# EAGLE board aleph-130111 (EAGLE 5.11), part 1 of 3
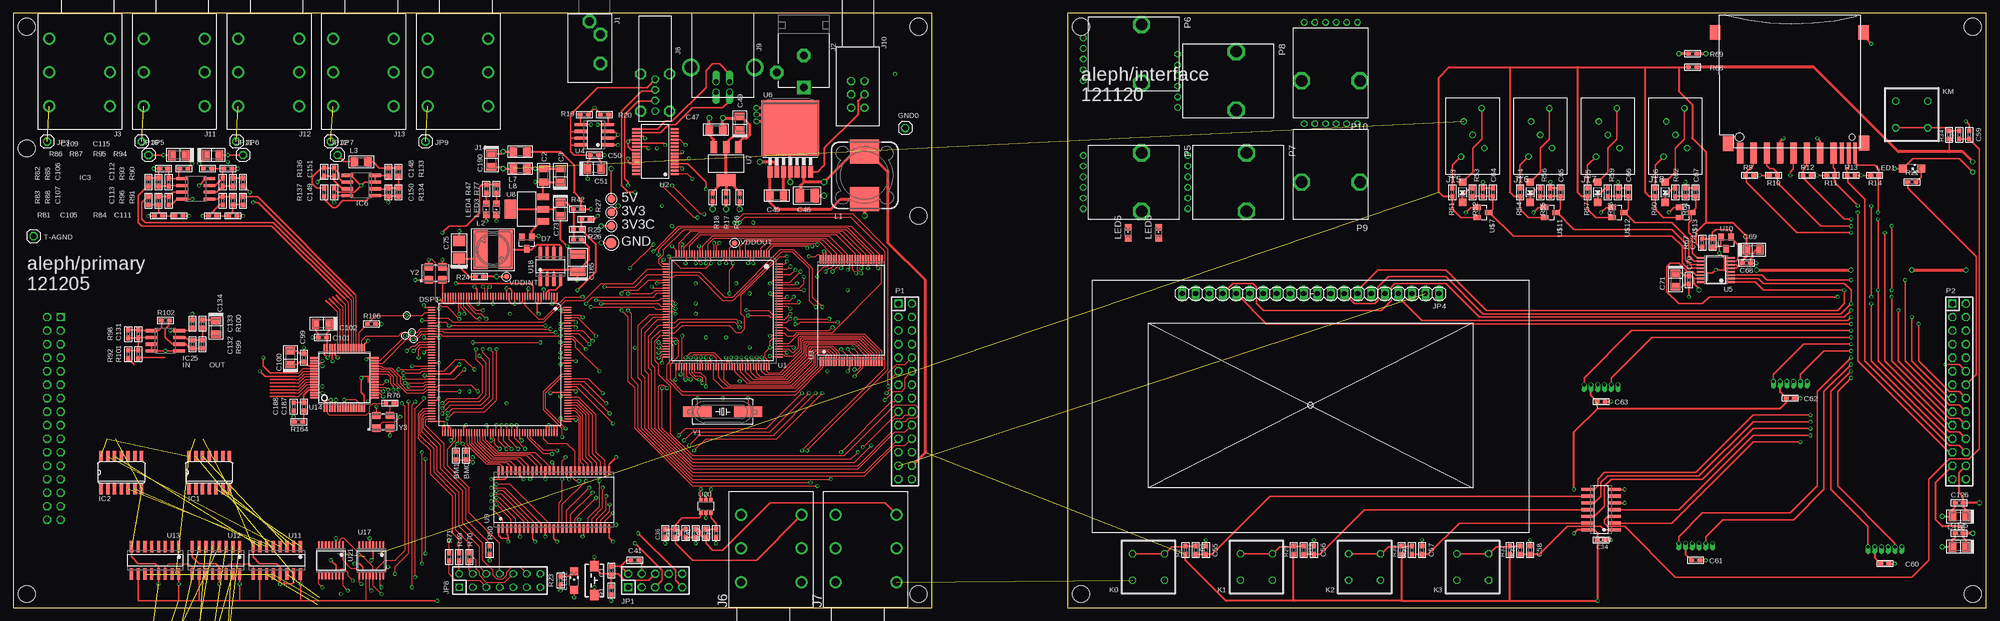
[diagram p8: board, top side]
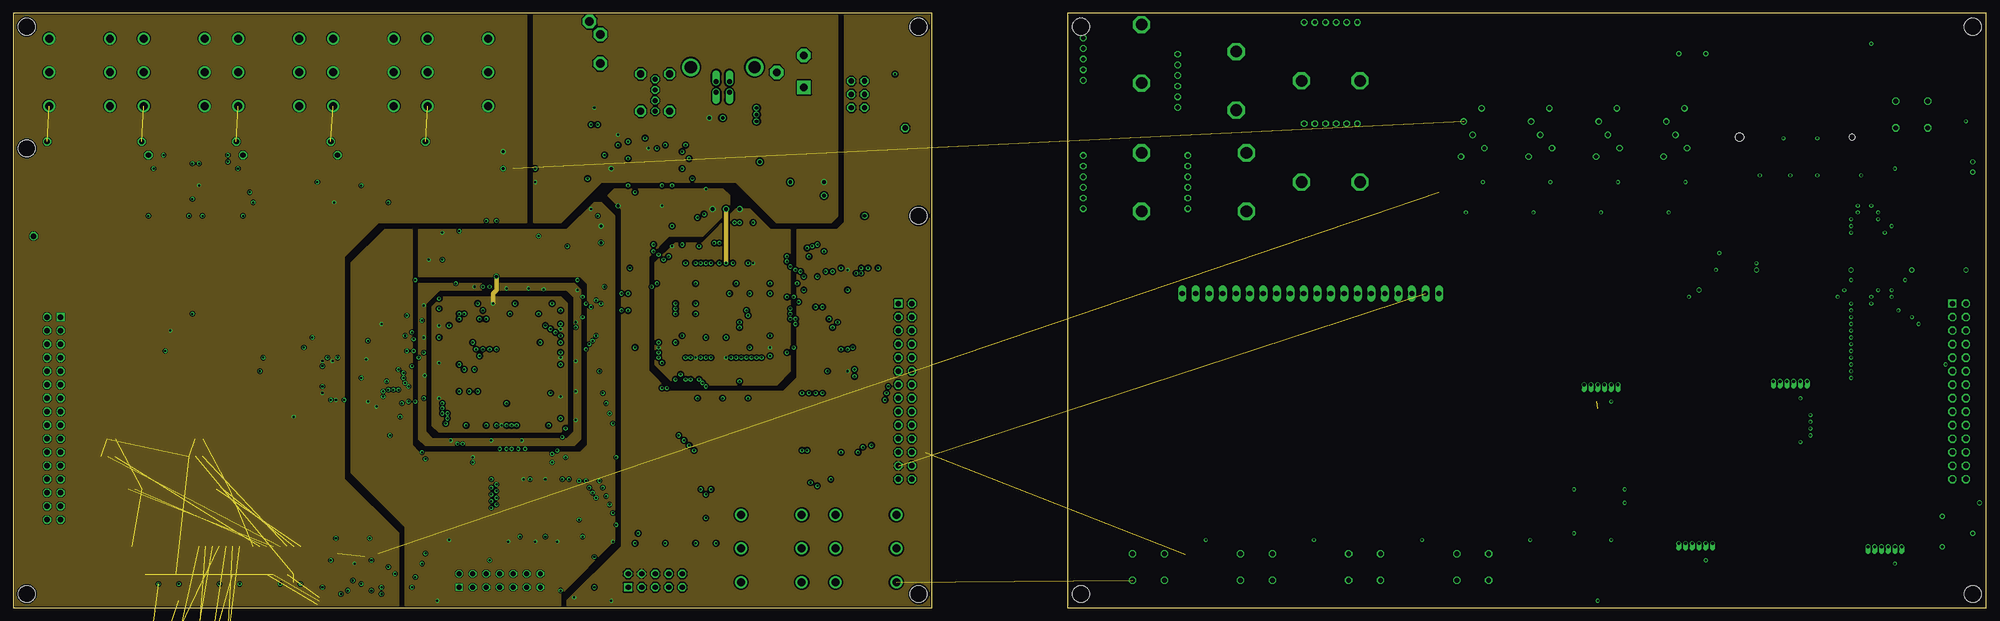
[diagram p9: board, inner layer Route2]
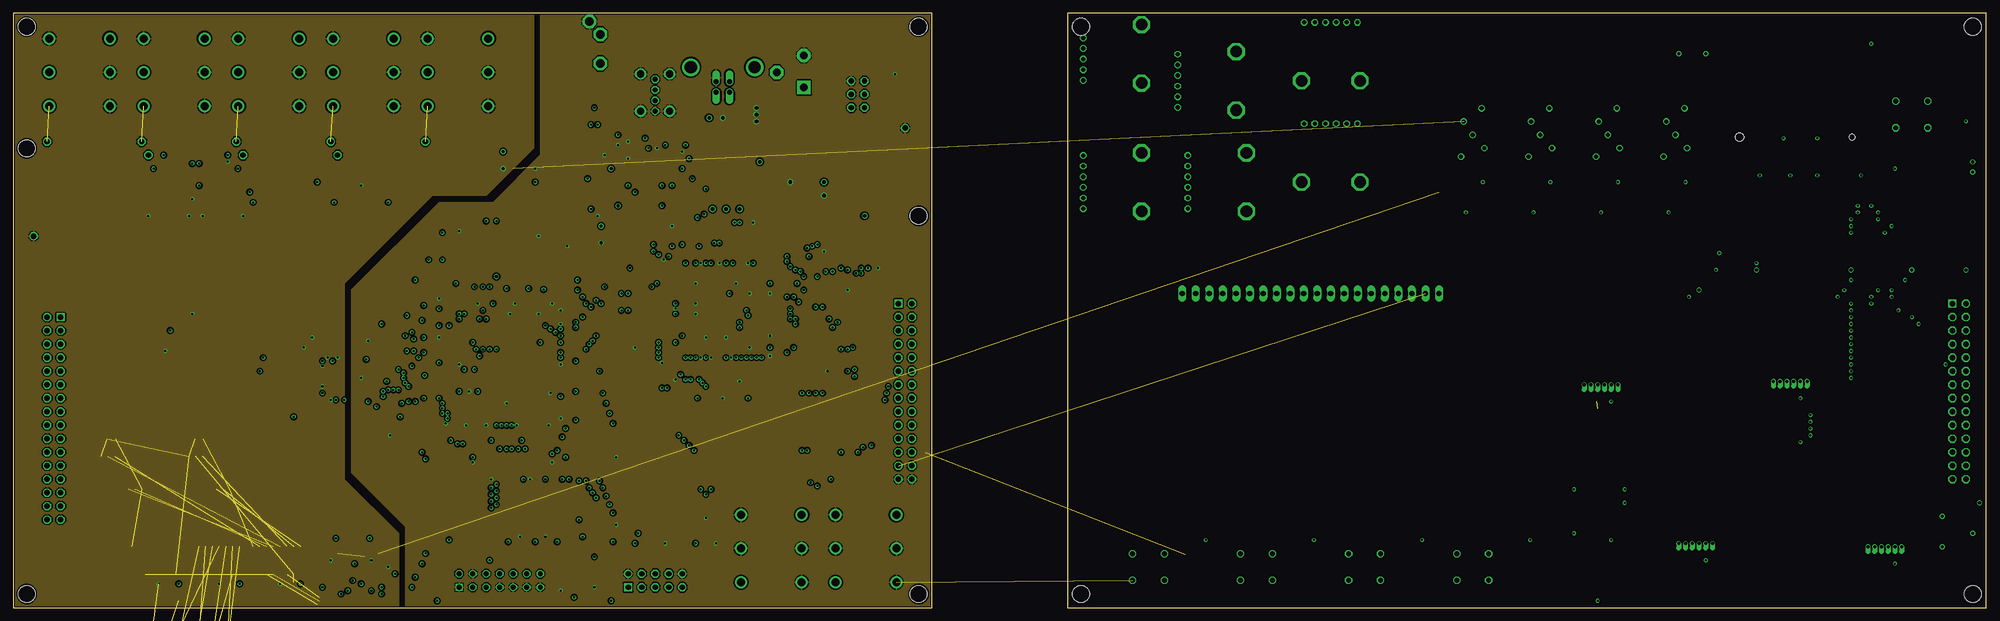
[diagram p10: board, inner layer Route3]
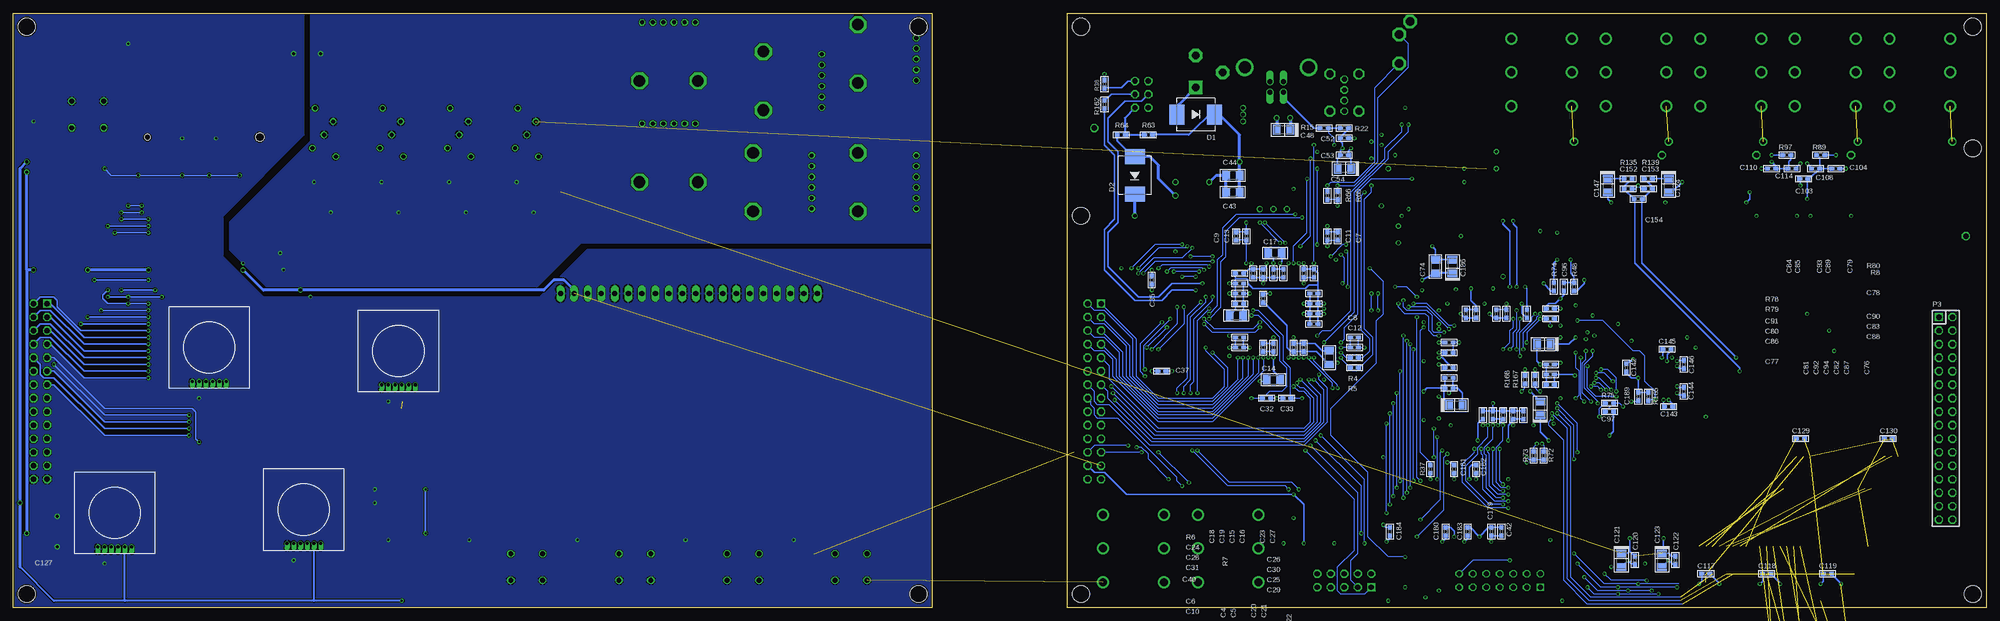
[diagram p11: board, bottom side, seen from below]

Size 370.84 x 111.76 mm. Coordinates in mm from the lower left corner, seen from the top.
Outline: 0,0 172.72,0 172.72,111.76 0,111.76 0,0
Outline: 198.12,0 370.84,0 370.84,111.76 198.12,111.76 198.12,0
Copper layers (1*2+3*16): Top 0.035mm / dielectric 1.5mm / Route2 0.035mm / dielectric 0.15mm / Route3 0.035mm / dielectric 0.2mm / Bottom 0.035mm
Design rules "default *": minimum track width 6mil, minimum drill 15mil, track to track 6mil, track to pad 6mil, pad to pad 6mil, via to via 6mil, smd to smd 6mil, copper to edge 10mil, drill to drill 8mil, minimum pad ring 6mil, minimum via ring 6mil, stop-mask expansion 4mil, vias tented up to drill 0mil, thermal gap 10mil
Holes 3.2 mm at 170.18,109.22 2.54,109.22 2.54,2.54 170.18,2.54 2.54,86.36 170.18,73.66 200.66,2.54 200.66,109.22 368.3,109.22 368.3,2.54

## Footprints (pad centres in the part's own frame; a part is rotated, then mirrored left to right if it is on the bottom)
SMD-15R = smd 1.5 x 1.5: TP 0,0
R0603 = smd 0.9 x 0.8: 1 -0.762,0; 2 0.762,0
C0603 = smd 0.9 x 0.8: 1 -0.762,0; 2 0.762,0
C1206 = smd 1.4 x 1.8: 1 -1.27,0; 2 1.27,0
C1206/T = smd 1.4 x 1.9: + 1.27,0; - -1.27,0
C3225 = smd 1.6 x 2.7: 1 -1.397,0; 2 1.397,0
C3528/T = smd 2 x 2.2: + 1.651,0; - -1.651,0
C1210/T = smd 1.6 x 3: + 1.651,0; - -1.651,0
SMC = smd 2.8 x 3.8: A 3.493,0; C -3.493,0
SOD123 = smd 1.4 x 1.4: A 1.905,0; C -1.905,0
SOT23 = smd 1 x 1.4: 1 -0.95,-1.1; 2 0.95,-1.1; 3 0,1.1
LQFP176 = smd 1.5 x 0.25: P$1 -12.8,10.75; P$2 -12.8,10.25; P$3 -12.8,9.75; P$4 -12.8,9.25; P$5 -12.8,8.75; P$6 -12.8,8.25; P$7 -12.8,7.75; P$8 -12.8,7.25; P$9 -12.8,6.75; P$10 -12.8,6.25; P$11 -12.8,5.75; P$12 -12.8,5.25; P$13 -12.8,4.75; P$14 -12.8,4.25; P$15 -12.8,3.75; P$16 -12.8,3.25; P$17 -12.8,2.75; P$18 -12.8,2.25; P$19 -12.8,1.75; P$20 -12.8,1.25; P$21 -12.8,0.75; P$22 -12.8,0.25; P$23 -12.8,-0.25; P$24 -12.8,-0.75; P$25 -12.8,-1.25; P$26 -12.8,-1.75; P$27 -12.8,-2.25; P$28 -12.8,-2.75; P$29 -12.8,-3.25; P$30 -12.8,-3.75; P$31 -12.8,-4.25; P$32 -12.8,-4.75; P$33 -12.8,-5.25; P$34 -12.8,-5.75; P$35 -12.8,-6.25; P$36 -12.8,-6.75; P$37 -12.8,-7.25; P$38 -12.8,-7.75; P$39 -12.8,-8.25; P$40 -12.8,-8.75; P$41 -12.8,-9.25; P$42 -12.8,-9.75; P$43 -12.8,-10.25; P$44 -12.8,-10.75; P$89 12.8,-10.75; P$90 12.8,-10.25; P$91 12.8,-9.75; P$92 12.8,-9.25; P$93 12.8,-8.75; P$94 12.8,-8.25; P$95 12.8,-7.75; P$96 12.8,-7.25; P$97 12.8,-6.75; P$98 12.8,-6.25; P$99 12.8,-5.75; P$100 12.8,-5.25; P$101 12.8,-4.75; P$102 12.8,-4.25; P$103 12.8,-3.75; P$104 12.8,-3.25; P$105 12.8,-2.75; P$106 12.8,-2.25; P$107 12.8,-1.75; P$108 12.8,-1.25; P$109 12.8,-0.75; P$110 12.8,-0.25; P$111 12.8,0.25; P$112 12.8,0.75; P$113 12.8,1.25; P$114 12.8,1.75; P$115 12.8,2.25; P$116 12.8,2.75; P$117 12.8,3.25; P$118 12.8,3.75; P$119 12.8,4.25; P$120 12.8,4.75; P$121 12.8,5.25; P$122 12.8,5.75; P$123 12.8,6.25; P$124 12.8,6.75; P$125 12.8,7.25; P$126 12.8,7.75; P$127 12.8,8.25; P$128 12.8,8.75; P$129 12.8,9.25; P$130 12.8,9.75; P$131 12.8,10.25; P$132 12.8,10.75 | smd 0.25 x 1.5: P$45 -10.75,-12.8; P$46 -10.25,-12.8; P$47 -9.75,-12.8; P$48 -9.25,-12.8; P$49 -8.75,-12.8; P$50 -8.25,-12.8; P$51 -7.75,-12.8; P$52 -7.25,-12.8; P$53 -6.75,-12.8; P$54 -6.25,-12.8; P$55 -5.75,-12.8; P$56 -5.25,-12.8; P$57 -4.75,-12.8; P$58 -4.25,-12.8; P$59 -3.75,-12.8; P$60 -3.25,-12.8; P$61 -2.75,-12.8; P$62 -2.25,-12.8; P$63 -1.75,-12.8; P$64 -1.25,-12.8; P$65 -0.75,-12.8; P$66 -0.25,-12.8; P$67 0.25,-12.8; P$68 0.75,-12.8; P$69 1.25,-12.8; P$70 1.75,-12.8; P$71 2.25,-12.8; P$72 2.75,-12.8; P$73 3.25,-12.8; P$74 3.75,-12.8; P$75 4.25,-12.8; P$76 4.75,-12.8; P$77 5.25,-12.8; P$78 5.75,-12.8; P$79 6.25,-12.8; P$80 6.75,-12.8; P$81 7.25,-12.8; P$82 7.75,-12.8; P$83 8.25,-12.8; P$84 8.75,-12.8; P$85 9.25,-12.8; P$86 9.75,-12.8; P$87 10.25,-12.8; P$88 10.75,-12.8; P$133 10.75,12.8; P$134 10.25,12.8; P$135 9.75,12.8; P$136 9.25,12.8; P$137 8.75,12.8; P$138 8.25,12.8; P$139 7.75,12.8; P$140 7.25,12.8; P$141 6.75,12.8; P$142 6.25,12.8; P$143 5.75,12.8; P$144 5.25,12.8; P$145 4.75,12.8; P$146 4.25,12.8; P$147 3.75,12.8; P$148 3.25,12.8; P$149 2.75,12.8; P$150 2.25,12.8; P$151 1.75,12.8; P$152 1.25,12.8; P$153 0.75,12.8; P$154 0.25,12.8; P$155 -0.25,12.8; P$156 -0.75,12.8; P$157 -1.25,12.8; P$158 -1.75,12.8; P$159 -2.25,12.8; P$160 -2.75,12.8; P$161 -3.25,12.8; P$162 -3.75,12.8; P$163 -4.25,12.8; P$164 -4.75,12.8; P$165 -5.25,12.8; P$166 -5.75,12.8; P$167 -6.25,12.8; P$168 -6.75,12.8; P$169 -7.25,12.8; P$170 -7.75,12.8; P$171 -8.25,12.8; P$172 -8.75,12.8; P$173 -9.25,12.8; P$174 -9.75,12.8; P$175 -10.25,12.8; P$176 -10.75,12.8
SMD-20R = smd 2 x 2: TP 0,0
1X01 = drill 1.016 octagon: 1 0,0
SO14 = smd 0.66 x 2.032: 1 -3.81,-3.073; 2 -2.54,-3.073; 3 -1.27,-3.073; 4 0,-3.073; 5 1.27,-3.073; 6 2.54,-3.073; 7 3.81,-3.073; 8 3.81,3.073; 9 2.54,3.073; 10 1.27,3.073; 11 0,3.073; 12 -1.27,3.073; 13 -2.54,3.073; 14 -3.81,3.073
SO8 = smd 0.6 x 2.2: 1 -1.905,-2.6; 2 -0.635,-2.6; 3 0.635,-2.6; 4 1.905,-2.6; 5 1.905,2.6; 6 0.635,2.6; 7 -0.635,2.6; 8 -1.905,2.6
SO08 = smd 0.6 x 2.2: 1 -1.905,-2.6; 2 -0.635,-2.6; 3 0.635,-2.6; 4 1.905,-2.6; 5 1.905,2.6; 6 0.635,2.6; 7 -0.635,2.6; 8 -1.905,2.6
SJ1-3533NG = drill 1.6 pad 2.54 octagon: 1 -1,-0.9; 2 1.4,1.1; 3 6.9,1.1
PJ-102XH = drill 1.422 pad 2.54 square: 1 0,0 | drill 1.422 pad 2.54 octagon: 2 0,-6.032; 3 5.08,-2.857
NEUTRIK-NRJ6HM-1 = drill 1.5 round: R 7.23,11.1; RN -4.2,11.1; S 7.23,4.75; SN -4.2,4.75; T 7.23,17.45; TN -4.2,17.45
DIL-100-2X08 = drill 1.016 square: 1 -8.89,-1.27 | drill 1.016 octagon: 2 -8.89,1.27; 3 -6.35,-1.27; 4 -6.35,1.27; 5 -3.81,-1.27; 6 -3.81,1.27; 7 -1.27,-1.27; 8 -1.27,1.27; 9 1.27,-1.27; 10 1.27,1.27; 11 3.81,-1.27; 12 3.81,1.27; 13 6.35,-1.27; 14 6.35,1.27; 15 8.89,-1.27; 16 8.89,1.27
USBA-VERT = drill 0.92 octagon: 1 0,-6; 2 0,-4; 3 0,-2; 4 0,0 | drill 1.35 octagon: G1 -2.72,0; G2 -2.72,-7; G3 2.72,-7; G4 2.72,0
USB_B = drill 0.95 offset: DM -1.25,4.71; DP -1.25,2.71; GND 1.25,2.71; VCC 1.25,4.71 | drill 2.3 round: MOUNT1 -6,0; MOUNT2 6,0
PHA2U = drill 1 octagon: 0 -1.25,0; 1 -1.25,-2.5; 2 -1.25,2.5; _0 1.25,0; _1 1.25,-2.5; _2 1.25,2.5
STX-3680 = drill 0.8 round: 1 -2.2,-4.1; 2 2.2,-2.5; 3 -1.7,2.5; 4 1.7,5; 5 0,0
AVR-JTAG-10 = drill 1.016 square: 1 -5.08,-1.27 | drill 1.016 octagon: 2 -5.08,1.27; 3 -2.54,-1.27; 4 -2.54,1.27; 5 0,-1.27; 6 0,1.27; 7 2.54,-1.27; 8 2.54,1.27; 9 5.08,-1.27; 10 5.08,1.27
1X20 = drill 1.016 long: 1 -24.13,0; 2 -21.59,0; 3 -19.05,0; 4 -16.51,0; 5 -13.97,0; 6 -11.43,0; 7 -8.89,0; 8 -6.35,0; 9 -3.81,0; 10 -1.27,0; 11 1.27,0; 12 3.81,0; 13 6.35,0; 14 8.89,0; 15 11.43,0; 16 13.97,0; 17 16.51,0; 18 19.05,0; 19 21.59,0; 20 24.13,0
JPQ-07 = drill 0.914 square: 1 -7.62,-1.27 | drill 0.914 octagon: 2 -7.62,1.27; 3 -5.08,-1.27; 4 -5.08,1.27; 5 -2.54,-1.27; 6 -2.54,1.27; 7 0,-1.27; 8 0,1.27; 9 2.54,-1.27; 10 2.54,1.27; 11 5.08,-1.27; 12 5.08,1.27; 13 7.62,-1.27; 14 7.62,1.27
PVA1 = drill 0.9 octagon: 1 -3,-2.5; 2 -3,2.5; 3 3,2.5; 4 3,-2.5
MSS1278 = smd 5.5 x 4.5: 1 0,4.5; 2 0,-4.5
SRR6038 = smd 7.3 x 2.6: 1 0,2.35; 2 0,-2.35
L1206 = smd 1.4 x 1.8: 1 -1.27,0; 2 1.27,0
CHIPLED_1206 = smd 1.5 x 1.5: A 0,-1.75; C 0,1.75
CHIPLED_0805 = smd 1.2 x 1.2: A 0,-1.05; C 0,1.05
DIL-100-2X14 = drill 1.016 square: 1 -16.51,-1.27 | drill 1.016 octagon: 2 -16.51,1.27; 3 -13.97,-1.27; 4 -13.97,1.27; 5 -11.43,-1.27; 6 -11.43,1.27; 7 -8.89,-1.27; 8 -8.89,1.27; 9 -6.35,-1.27; 10 -6.35,1.27; 11 -3.81,-1.27; 12 -3.81,1.27; 13 -1.27,-1.27; 14 -1.27,1.27; 15 1.27,-1.27; 16 1.27,1.27; 17 3.81,-1.27; 18 3.81,1.27; 19 6.35,-1.27; 20 6.35,1.27; 21 8.89,-1.27; 22 8.89,1.27; 23 11.43,-1.27; 24 11.43,1.27; 25 13.97,-1.27; 26 13.97,1.27; 27 16.51,-1.27; 28 16.51,1.27
DIL-100-2X16 = drill 1.016 square: 1 -19.05,-1.27 | drill 1.016 octagon: 2 -19.05,1.27; 3 -16.51,-1.27; 4 -16.51,1.27; 5 -13.97,-1.27; 6 -13.97,1.27; 7 -11.43,-1.27; 8 -11.43,1.27; 9 -8.89,-1.27; 10 -8.89,1.27; 11 -6.35,-1.27; 12 -6.35,1.27; 13 -3.81,-1.27; 14 -3.81,1.27; 15 -1.27,-1.27; 16 -1.27,1.27; 17 1.27,-1.27; 18 1.27,1.27; 19 3.81,-1.27; 20 3.81,1.27; 21 6.35,-1.27; 22 6.35,1.27; 23 8.89,-1.27; 24 8.89,1.27; 25 11.43,-1.27; 26 11.43,1.27; 27 13.97,-1.27; 28 13.97,1.27; 29 16.51,-1.27; 30 16.51,1.27; 31 19.05,-1.27; 32 19.05,1.27
EVJ-POT = drill 0.8 octagon: 1 -5,-11; 2 -3,-11; 3 -1,-11; 4 1,-11; 5 3,-11; 6 5,-11 | drill 2.2 octagon: M1 -5.5,0; M2 5.5,0
LQFP144 = smd 0.25 x 1.5: 1 -8.75,-10.6; 2 -8.25,-10.6; 3 -7.75,-10.6; 4 -7.25,-10.6; 5 -6.75,-10.6; 6 -6.25,-10.6; 7 -5.75,-10.6; 8 -5.25,-10.6; 9 -4.75,-10.6; 10 -4.25,-10.6; 11 -3.75,-10.6; 12 -3.25,-10.6; 13 -2.75,-10.6; 14 -2.25,-10.6; 15 -1.75,-10.6; 16 -1.25,-10.6; 17 -0.75,-10.6; 18 -0.25,-10.6; 19 0.25,-10.6; 20 0.75,-10.6; 21 1.25,-10.6; 22 1.75,-10.6; 23 2.25,-10.6; 24 2.75,-10.6; 25 3.25,-10.6; 26 3.75,-10.6; 27 4.25,-10.6; 28 4.75,-10.6; 29 5.25,-10.6; 30 5.75,-10.6; 31 6.25,-10.6; 32 6.75,-10.6; 33 7.25,-10.6; 34 7.75,-10.6; 35 8.25,-10.6; 36 8.75,-10.6; 73 8.75,10.6; 74 8.25,10.6; 75 7.75,10.6; 76 7.25,10.6; 77 6.75,10.6; 78 6.25,10.6; 79 5.75,10.6; 80 5.25,10.6; 81 4.75,10.6; 82 4.25,10.6; 83 3.75,10.6; 84 3.25,10.6; 85 2.75,10.6; 86 2.25,10.6; 87 1.75,10.6; 88 1.25,10.6; 89 0.75,10.6; 90 0.25,10.6; 91 -0.25,10.6; 92 -0.75,10.6; 93 -1.25,10.6; 94 -1.75,10.6; 95 -2.25,10.6; 96 -2.75,10.6; 97 -3.25,10.6; 98 -3.75,10.6; 99 -4.25,10.6; 100 -4.75,10.6; 101 -5.25,10.6; 102 -5.75,10.6; 103 -6.25,10.6; 104 -6.75,10.6; 105 -7.25,10.6; 106 -7.75,10.6; 107 -8.25,10.6; 108 -8.75,10.6 | smd 1.5 x 0.25: 37 10.6,-8.75; 38 10.6,-8.25; 39 10.6,-7.75; 40 10.6,-7.25; 41 10.6,-6.75; 42 10.6,-6.25; 43 10.6,-5.75; 44 10.6,-5.25; 45 10.6,-4.75; 46 10.6,-4.25; 47 10.6,-3.75; 48 10.6,-3.25; 49 10.6,-2.75; 50 10.6,-2.25; 51 10.6,-1.75; 52 10.6,-1.25; 53 10.6,-0.75; 54 10.6,-0.25; 55 10.6,0.25; 56 10.6,0.75; 57 10.6,1.25; 58 10.6,1.75; 59 10.6,2.25; 60 10.6,2.75; 61 10.6,3.25; 62 10.6,3.75; 63 10.6,4.25; 64 10.6,4.75; 65 10.6,5.25; 66 10.6,5.75; 67 10.6,6.25; 68 10.6,6.75; 69 10.6,7.25; 70 10.6,7.75; 71 10.6,8.25; 72 10.6,8.75; 109 -10.6,8.75; 110 -10.6,8.25; 111 -10.6,7.75; 112 -10.6,7.25; 113 -10.6,6.75; 114 -10.6,6.25; 115 -10.6,5.75; 116 -10.6,5.25; 117 -10.6,4.75; 118 -10.6,4.25; 119 -10.6,3.75; 120 -10.6,3.25; 121 -10.6,2.75; 122 -10.6,2.25; 123 -10.6,1.75; 124 -10.6,1.25; 125 -10.6,0.75; 126 -10.6,0.25; 127 -10.6,-0.25; 128 -10.6,-0.75; 129 -10.6,-1.25; 130 -10.6,-1.75; 131 -10.6,-2.25; 132 -10.6,-2.75; 133 -10.6,-3.25; 134 -10.6,-3.75; 135 -10.6,-4.25; 136 -10.6,-4.75; 137 -10.6,-5.25; 138 -10.6,-5.75; 139 -10.6,-6.25; 140 -10.6,-6.75; 141 -10.6,-7.25; 142 -10.6,-7.75; 143 -10.6,-8.25; 144 -10.6,-8.75
SSOP28 = smd 0.4 x 1.5: 1 -4.225,-3.625; 2 -3.575,-3.625; 3 -2.925,-3.625; 4 -2.275,-3.625; 5 -1.625,-3.625; 6 -0.975,-3.625; 7 -0.325,-3.625; 8 0.325,-3.625; 9 0.975,-3.625; 10 1.625,-3.625; 11 2.275,-3.625; 12 2.925,-3.625; 13 3.575,-3.625; 14 4.225,-3.625; 15 4.225,3.625; 16 3.575,3.625; 17 2.925,3.625; 18 2.275,3.625; 19 1.625,3.625; 20 0.975,3.625; 21 0.325,3.625; 22 -0.325,3.625; 23 -0.975,3.625; 24 -1.625,3.625; 25 -2.275,3.625; 26 -2.925,3.625; 27 -3.575,3.625; 28 -4.225,3.625
TSOP48 = smd 0.3 x 1.6: 1 -5.75,-9.6; 2 -5.25,-9.6; 3 -4.75,-9.6; 4 -4.25,-9.6; 5 -3.75,-9.6; 6 -3.25,-9.6; 7 -2.75,-9.6; 8 -2.25,-9.6; 9 -1.75,-9.6; 10 -1.25,-9.6; 11 -0.75,-9.6; 12 -0.25,-9.6; 13 0.25,-9.6; 14 0.75,-9.6; 15 1.25,-9.6; 16 1.75,-9.6; 17 2.25,-9.6; 18 2.75,-9.6; 19 3.25,-9.6; 20 3.75,-9.6; 21 4.25,-9.6; 22 4.75,-9.6; 23 5.25,-9.6; 24 5.75,-9.6; 25 5.75,9.6; 26 5.25,9.6; 27 4.75,9.6; 28 4.25,9.6; 29 3.75,9.6; 30 3.25,9.6; 31 2.75,9.6; 32 2.25,9.6; 33 1.75,9.6; 34 1.25,9.6; 35 0.75,9.6; 36 0.25,9.6; 37 -0.25,9.6; 38 -0.75,9.6; 39 -1.25,9.6; 40 -1.75,9.6; 41 -2.25,9.6; 42 -2.75,9.6; 43 -3.25,9.6; 44 -3.75,9.6; 45 -4.25,9.6; 46 -4.75,9.6; 47 -5.25,9.6; 48 -5.75,9.6
TSSOP16 = smd 0.3 x 1.5: 1 -2.275,-2.8; 2 -1.625,-2.8; 3 -0.975,-2.8; 4 -0.325,-2.8; 5 0.325,-2.8; 6 0.975,-2.8; 7 1.625,-2.8; 8 2.275,-2.8; 9 2.275,2.8; 10 1.625,2.8; 11 0.975,2.8; 12 0.325,2.8; 13 -0.325,2.8; 14 -0.975,2.8; 15 -1.625,2.8; 16 -2.275,2.8
TO263-7 = smd 0.914 x 2.159: 1 -3.81,-5.715; 2 -2.54,-5.715; 3 -1.27,-5.715; 4 0,-5.715; 5 1.27,-5.715; 6 2.54,-5.715; 7 3.81,-5.715 | smd 10.8 x 10.41: 8 0,2.54
SOT223 = smd 1.219 x 2.235: 1 -2.311,-3.099; 2 0,-3.099; 3 2.311,-3.099 | smd 3.6 x 2.2: 4 0,3.099
TSOP54 = smd 0.4 x 1.6: 1 -10.4,-5.45; 2 -9.6,-5.45; 3 -8.8,-5.45; 4 -8,-5.45; 5 -7.2,-5.45; 6 -6.4,-5.45; 7 -5.6,-5.45; 8 -4.8,-5.45; 9 -4,-5.45; 10 -3.2,-5.45; 11 -2.4,-5.45; 12 -1.6,-5.45; 13 -0.8,-5.45; 14 0,-5.45; 15 0.8,-5.45; 16 1.6,-5.45; 17 2.4,-5.45; 18 3.2,-5.45; 19 4,-5.45; 20 4.8,-5.45; 21 5.6,-5.45; 22 6.4,-5.45; 23 7.2,-5.45; 24 8,-5.45; 25 8.8,-5.45; 26 9.6,-5.45; 27 10.4,-5.45; 28 10.4,5.45; 29 9.6,5.45; 30 8.8,5.45; 31 8,5.45; 32 7.2,5.45; 33 6.4,5.45; 34 5.6,5.45; 35 4.8,5.45; 36 4,5.45; 37 3.2,5.45; 38 2.4,5.45; 39 1.6,5.45; 40 0.8,5.45; 41 0,5.45; 42 -0.8,5.45; 43 -1.6,5.45; 44 -2.4,5.45; 45 -3.2,5.45; 46 -4,5.45; 47 -4.8,5.45; 48 -5.6,5.45; 49 -6.4,5.45; 50 -7.2,5.45; 51 -8,5.45; 52 -8.8,5.45; 53 -9.6,5.45; 54 -10.4,5.45
SO16 = smd 0.6 x 2.2: 1 -4.445,-2.6; 2 -3.175,-2.6; 3 -1.905,-2.6; 4 -0.635,-2.6; 5 0.635,-2.6; 6 1.905,-2.6; 7 3.175,-2.6; 8 4.445,-2.6; 9 4.445,2.6; 10 3.175,2.6; 11 1.905,2.6; 12 0.635,2.6; 13 -0.635,2.6; 14 -1.905,2.6; 15 -3.175,2.6; 16 -4.445,2.6
SQFP-S-10X10-64 = smd 0.3 x 1.6: 1 -3.75,-5.6; 2 -3.25,-5.6; 3 -2.75,-5.6; 4 -2.25,-5.6; 5 -1.75,-5.6; 6 -1.25,-5.6; 7 -0.75,-5.6; 8 -0.25,-5.6; 9 0.25,-5.6; 10 0.75,-5.6; 11 1.25,-5.6; 12 1.75,-5.6; 13 2.25,-5.6; 14 2.75,-5.6; 15 3.25,-5.6; 16 3.75,-5.6; 33 3.75,5.6; 34 3.25,5.6; 35 2.75,5.6; 36 2.25,5.6; 37 1.75,5.6; 38 1.25,5.6; 39 0.75,5.6; 40 0.25,5.6; 41 -0.25,5.6; 42 -0.75,5.6; 43 -1.25,5.6; 44 -1.75,5.6; 45 -2.25,5.6; 46 -2.75,5.6; 47 -3.25,5.6; 48 -3.75,5.6 | smd 1.6 x 0.3: 17 5.6,-3.75; 18 5.6,-3.25; 19 5.6,-2.75; 20 5.6,-2.25; 21 5.6,-1.75; 22 5.6,-1.25; 23 5.6,-0.75; 24 5.6,-0.25; 25 5.6,0.25; 26 5.6,0.75; 27 5.6,1.25; 28 5.6,1.75; 29 5.6,2.25; 30 5.6,2.75; 31 5.6,3.25; 32 5.6,3.75; 49 -5.6,3.75; 50 -5.6,3.25; 51 -5.6,2.75; 52 -5.6,2.25; 53 -5.6,1.75; 54 -5.6,1.25; 55 -5.6,0.75; 56 -5.6,0.25; 57 -5.6,-0.25; 58 -5.6,-0.75; 59 -5.6,-1.25; 60 -5.6,-1.75; 61 -5.6,-2.25; 62 -5.6,-2.75; 63 -5.6,-3.25; 64 -5.6,-3.75
SO14' = smd 0.6 x 2.2: 1 -3.81,-2.6; 2 -2.54,-2.6; 3 -1.27,-2.6; 4 0,-2.6; 5 1.27,-2.6; 6 2.54,-2.6; 7 3.81,-2.6; 8 3.81,2.6; 9 2.54,2.6; 10 1.27,2.6; 11 0,2.6; 12 -1.27,2.6; 13 -2.54,2.6; 14 -3.81,2.6
SOT23-6 = smd 0.6 x 0.9: 1 -0.95,-1.15; 2 0,-1.15; 3 0.95,-1.15; 4 0.95,1.15; 5 0,1.15; 6 -0.95,1.15
PANASONIC-EVQ = smd 2 x 1.6: 1 2.7,0; 2 -2.7,0
BOURNS-EM14 = drill 0.6 pad 0.813 offset: P$1 -3.175,-6.35; P$2 -1.905,-6.35; P$3 -0.635,-6.35; P$4 0.635,-6.35; P$5 1.905,-6.35; P$6 3.175,-6.35
06132 = smd 1.2 x 4: 1 6.9,0.9; 2 4.4,0.9; 3 1.9,0.9; 4 -0.6,0.9; 5 -3.1,0.9; 6 -5.6,0.9; 7 -8.1,0.9; 9 9.4,0.9 | smd 0.7 x 4: 8 -9.7,0.9; CD -11,0.9; WP -12.2,0.9 | smd 2 x 2.8: GP -13.8,-21.8; GP2 14.1,-21.8; GP3 11.7,-0.9; GP4 -13.9,-1 | hole 1.1: -11.6,-2.1 | hole 1.6: 9.5,-2.1
SMD-10R = smd 1 x 1: TP 0,0
HC49UP@1 = smd 5.334 x 1.93: 1 -4.763,0; 2 4.763,0
ASFL1 = smd 1.7 x 1.5: 1 -1.27,-1.2; 2 1.27,-1.2; 3 1.27,1.2; 4 -1.27,1.2

## Placement (x,y rotation side)
3V3  TPS-SMD-15R  [SMD-15R]  112.39,74.3 0 top
3V3C  TPS-SMD-15R  [SMD-15R]  112.39,71.75 0 top
5V  TPS-SMD-15R  [SMD-15R]  112.39,76.83 0 top
BM0  0  [R0603]  85.09,28.57 90 top
BM1  DNP  [R0603]  83.19,28.57 90 top
C1  100n  [C0603]  112.39,6.99 90 top
C2  100n  [C1206]  99.69,81.28 270 top
C3  10u  [C1206/T]  102.87,81.28 270 top
C4  100n  [C0603]  135.89,48.9 90 bottom
C5  33n  [C0603]  133.99,48.9 90 bottom
C6  100n  [C0603]  140.34,50.8 0 bottom
C7  100n  [C0603]  121.92,69.85 90 bottom
C8  100n  [C0603]  118.75,50.8 0 bottom
C9  100n  [C0603]  140.97,69.85 90 bottom
C10  33n  [C0603]  140.34,48.9 0 bottom
C11  33n  [C0603]  123.83,69.85 90 bottom
C12  33n  [C0603]  118.75,48.9 0 bottom
C13  33n  [C0603]  139.06,69.85 90 bottom
C14  4.7u  [C1206]  133.99,42.86 180 bottom
C15  33n  [C0603]  133.99,62.87 270 bottom
C16  100n  [C0603]  132.08,62.87 270 bottom
C17  4.7u  [C1206]  133.67,66.67 0 bottom
C18  2.2u  [C0603]  137.79,62.87 270 bottom
C19  470p  [C0603]  135.89,62.87 270 bottom
C20  2.7n  [C0603]  130.18,48.9 90 bottom
C21  33n  [C0603]  128.27,48.9 90 bottom
C22  2.2u  [C1206]  123.51,46.99 90 bottom
C23  2.7n  [C0603]  128.27,62.87 270 bottom
C24  2.7n  [C0603]  140.34,60.96 0 bottom
C25  2.7n  [C0603]  126.36,55.24 180 bottom
C26  2.7n  [C0603]  126.36,59.05 180 bottom
C27  33n  [C0603]  126.36,62.87 270 bottom
C28  33n  [C0603]  140.34,59.05 0 bottom
C29  33n  [C0603]  126.36,53.34 180 bottom
C30  33n  [C0603]  126.36,57.15 180 bottom
C31  100n  [C0603]  140.34,57.15 0 bottom
C32  18p  [C0603]  135.25,39.37 0 bottom
C33  18p  [C0603]  131.44,39.37 180 bottom
C34  100n  [C0603]  298.45,12.7 180 top
C35  10n  [C0603]  156.84,61.59 270 bottom
C36  1u  [C0603]  122.56,13.97 90 top
C37  10n  [C0603]  154.94,44.45 0 bottom
C38  1u  [C0603]  132.08,13.97 90 top
C39  100n  [C0603]  25.4,-11.43 90 top  (outside the outline)
C40  2.2u  [C1206]  140.97,54.93 0 bottom
C41  100n  [C0603]  116.84,8.89 180 top
C42  10n  [C0603]  91.12,14.29 270 bottom
C43  22u  [C1206]  141.6,78.11 0 bottom
C44  470n  [C1206]  141.6,81.28 0 bottom
C45  10n  [C1206]  143.51,77.47 0 top
C46  47u  [C3225]  149.22,77.47 0 top
C47  100n  [C1206]  132.08,89.85 180 top
C48  10u  [C1206/T]  132.08,89.85 0 bottom
C49  10u  [C1206/T]  136.53,91.12 270 top
C50  100n  [C0603]  109.22,85.09 180 top
C51  4.7u  [C1206/T]  109.22,82.55 180 top
C52  100n  [C0603]  120.65,88.27 0 bottom
C53  100n  [C0603]  120.65,85.09 0 bottom
C54  4.7u  [C1206/T]  120.65,82.55 0 bottom
C55  1u  [C0603]  224.16,10.79 270 top
C56  1u  [C0603]  244.47,10.79 270 top
C57  1u  [C0603]  264.8,10.79 270 top
C58  1u  [C0603]  285.12,10.79 270 top
C59  1u  [C0603]  367.67,88.9 270 top
C60  100n  [C0603]  351.79,8.26 180 top
C61  100n  [C0603]  316.23,8.89 180 top
C62  100n  [C0603]  334.01,39.37 180 top
C63  100n  [C0603]  298.45,38.73 180 top
C64  10n  [C0603]  278.13,78.11 90 top
C65  10n  [C0603]  290.83,78.11 90 top
C66  10n  [C0603]  303.53,78.11 90 top
C67  10n  [C0603]  316.23,78.11 90 top
C68  100n  [C0603]  325.75,64.77 180 top
C69  10u  [C1206/T]  327.02,67.31 180 top
C70  100n  [C0603]  314.96,61.59 90 top
C71  10u  [C1206/T]  312.42,61.59 90 top
C72  100n  [C0603]  319.4,68.58 90 top
C73  10u  [C1206/T]  102.87,74.93 90 top
C74  100n  [C1206]  103.5,64.14 270 bottom
C75  100u  [C3528/T]  83.82,67.31 270 top
C76  10u  [C1206/T]  83.82,37.47 270 bottom
C77  10u  [C1206/T]  99.69,38.1 180 bottom
C78  10u  [C1206/T]  83.19,49.53 0 bottom
C79  100n  [C0603]  86.36,55.24 90 bottom
C80  100n  [C0603]  100.97,43.18 180 bottom
C81  100n  [C0603]  94.61,36.2 270 bottom
C82  100n  [C0603]  88.9,36.2 270 bottom
C83  100n  [C0603]  81.92,43.81 0 bottom
C84  100n  [C0603]  97.79,55.24 90 bottom
C85  10n  [C0603]  95.89,55.24 90 bottom
C86  10n  [C0603]  100.97,41.27 180 bottom
C87  10n  [C0603]  87,36.2 270 bottom
C88  10n  [C0603]  81.92,41.91 0 bottom
C89  100n  [C0603]  90.17,55.24 90 bottom
C90  100n  [C0603]  81.92,45.72 0 bottom
C91  100n  [C0603]  100.97,45.09 0 bottom
C92  100n  [C0603]  92.71,36.2 270 bottom
C93  10n  [C0603]  92.08,55.24 90 bottom
C94  10n  [C0603]  90.81,36.2 270 bottom
C95  100n  [C0603]  30.48,-21.59 90 top  (outside the outline)
C96  10n  [C0603]  79.38,60.33 270 bottom
C97  10n  [C0603]  70.8,36.83 0 bottom
C99  100n  [C0603]  54.61,46.99 270 top
C100  47u  [C1206/T]  52.07,46.99 270 top
C101  100n  [C0603]  58.1,50.8 0 top
C102  10u  [C1206/T]  58.1,53.34 0 top
C103  100n  [C0603]  34.29,80.64 180 bottom
C104  270p  [C0603]  28.26,82.55 0 bottom
C105  560p  [C0603]  31.11,73.66 0 top
C106  68p  [C0603]  29.21,80.01 90 top
C107  220p  [C0603]  29.21,76.52 90 top
C108  2200p  [C0603]  32.07,82.55 180 bottom
C109  10u  [C1206/T]  31.11,85.09 0 top
C110  270p  [C0603]  40.32,82.55 180 bottom
C111  560p  [C0603]  41.27,73.66 0 top
C112  68p  [C0603]  39.37,80.01 90 top
C113  220p  [C0603]  39.37,76.52 90 top
C114  2200p  [C0603]  36.51,82.55 0 bottom
C115  10u  [C1206/T]  37.47,85.09 180 top
C117  100n  [C0603]  52.7,6.35 0 bottom
C118  100n  [C0603]  41.27,6.35 0 bottom
C119  100n  [C0603]  29.84,6.35 0 bottom
C120  100n  [C0603]  66.04,8.89 270 bottom
C121  10u  [C1206/T]  68.58,8.89 90 bottom
C122  100n  [C0603]  58.42,8.89 270 bottom
C123  10u  [C1206/T]  60.96,8.89 90 bottom
C124  4.7u  [C1206/T]  59.69,79.38 90 bottom
C125  100n  [C0603]  365.76,13.97 0 top
C126  100n  [C0603]  365.76,19.68 0 top
C127  10u  [C1206/T]  365.76,11.43 0 top
C128  10u  [C1206/T]  365.76,17.14 0 top
C129  100n  [C0603]  34.92,31.75 180 bottom
C130  100n  [C0603]  18.41,31.75 180 bottom
C131  27p  [C0603]  23.5,51.44 90 top
C132  47p  [C0603]  33.66,49.53 90 top
C133  100n  [C0603]  33.66,53.34 90 top
C134  10u  [C1206/T]  38.1,52.7 90 top
C142  100n  [C0603]  67.63,45.09 270 bottom
C143  100n  [C0603]  59.69,37.78 0 bottom
C144  100n  [C0603]  56.83,40.64 90 bottom
C145  100n  [C0603]  60.01,48.58 180 bottom
C146  100n  [C0603]  56.83,45.72 270 bottom
C147  4.7u  [C1206/T]  71.12,79.38 90 bottom
C148  100p  [C0603]  70.48,81.92 90 top
C149  100n  [C0603]  60.33,78.11 270 top
C150  120p  [C0603]  70.48,78.11 90 top
C151  120p  [C0603]  60.33,81.92 90 top
C152  1n  [C0603]  67.31,78.74 0 bottom
C153  1n  [C0603]  63.5,78.74 0 bottom
C154  100p  [C0603]  65.41,76.83 0 bottom
C179  10n  [C0603]  93.03,14.29 270 bottom
C180  10n  [C0603]  101.6,14.29 270 bottom
C181  10n  [C0603]  100.01,26.04 270 bottom
C182  10n  [C0603]  95.89,26.04 270 bottom
C183  10n  [C0603]  97.47,14.29 270 bottom
C184  10n  [C0603]  112.08,14.29 270 bottom
C185  100u  [C1210/T]  106.05,64.77 270 top
C186  10u  [C1206/T]  100.33,64.14 270 bottom
C187  5600p  [C0603]  54.61,37.78 90 top
C188  390p  [C0603]  52.7,37.78 90 top
C189  100n  [C0603]  65.41,39.69 90 bottom
C190  10u  [C1206/T]  89.85,84.14 90 top
D1  MBRS360T3  [SMC]  148.59,92.71 180 bottom
D2  MBRS360T3  [SMC]  160.02,81.28 90 bottom
D3  1N4148W-7  [SOD123]  272.42,78.11 90 top
D4  1N4148W-7  [SOD123]  285.12,78.11 90 top
D5  1N4148W-7  [SOD123]  297.81,78.11 90 top
D6  1N4148W-7  [SOD123]  310.51,78.11 90 top
D7  zhcs1000  [SOT23]  96.52,68.58 180 top
DSP1  BF533  [LQFP176]  91.44,45.72 270 top
GND  TPS-SMD-20R  [SMD-20R]  112.39,68.58 0 top
GND0  [1X01]  167.64,90.17 0 top
IC1  4066D  [SO14]  36.83,25.4 0 top
IC2  4066D  [SO14]  20.32,25.4 0 top
IC3  AD8606  [SO8]  34.29,78.74 270 top
IC4  4066D  [SO14]  31.75,-11.43 0 top  (outside the outline)
IC5  4066D  [SO14]  36.83,-21.59 0 top  (outside the outline)
IC6  AD8606  [SO8]  65.41,79.38 90 top
IC25  TL072D  [SO08]  28.57,50.16 270 top
J1  SJ1-3533NG  [SJ1-3533NG]  109.22,109.22 270 top
J2  PJ-102AH/BH  [PJ-102XH]  148.59,97.79 180 top
J3  STEREOSW2GND  [NEUTRIK-NRJ6HM-1]  13.97,111.76 180 top
J4  F-2X08-DIL-100  [DIL-100-2X08]  295.27,119.06 180 top  (outside the outline)
J5  F-2X08-DIL-100  [DIL-100-2X08]  98.42,130.18 90 top  (outside the outline)
J6  STEREOSW2GND  [NEUTRIK-NRJ6HM-1]  140.97,0 0 top
J7  STEREOSW2GND  [NEUTRIK-NRJ6HM-1]  158.75,0 0 top
J8  USBA-VERT  [USBA-VERT]  120.65,93.34 180 top
J9  [USB_B]  133.35,101.6 180 top
J10  PHA2U  [PHA2U]  158.75,96.52 180 top
J11  STEREOSW2GND  [NEUTRIK-NRJ6HM-1]  31.75,111.76 180 top
J12  STEREOSW2GND  [NEUTRIK-NRJ6HM-1]  49.53,111.76 180 top
J13  STEREOSW2GND  [NEUTRIK-NRJ6HM-1]  67.31,111.76 180 top
J14  STEREOSW2GND  [NEUTRIK-NRJ6HM-1]  85.09,111.76 180 top
J15  STX-3680  [STX-3680]  274.32,88.9 0 top
J16  STX-3680  [STX-3680]  287.02,88.9 0 top
J17  STX-3680  [STX-3680]  299.72,88.9 0 top
J18  STX-3680  [STX-3680]  312.42,88.9 0 top
J19  SJ1-3533NG  [SJ1-3533NG]  110.49,130.81 270 top  (outside the outline)
JP1  AVR-JTAG  [AVR-JTAG-10]  120.65,5.08 0 top
JP3  [1X01]  6.35,87.63 0 top
JP4  OLED  [1X20]  243.84,59.05 180 top
JP5  [1X01]  24.13,87.63 0 top
JP6  [1X01]  41.91,87.63 0 top
JP7  [1X01]  59.69,87.63 0 top
JP8  JPQ-07-100  [JPQ-07]  91.44,5.08 0 top
JP9  [1X01]  77.47,87.63 0 top
JP10  [1X01]  25.4,85.09 0 top
JP11  [1X01]  43.18,85.09 0 top
JP12  [1X01]  60.96,85.09 270 top
K0  PVA1  [PVA1]  213.36,7.62 180 top
K1  PVA1  [PVA1]  233.68,7.62 180 top
K2  PVA1  [PVA1]  254,7.62 180 top
K3  PVA1  [PVA1]  274.32,7.62 180 top
KM  PVA1  [PVA1]  356.87,92.71 0 top
L1  MSS1278  [MSS1278]  160.02,81.28 180 top
L2  SRR6038-100Y  [SRR6038]  90.17,67.31 270 top
L3  600  [L1206]  65.41,83.82 180 top
L7  600  [L1206]  95.25,85.72 0 top
L8  600  [L1206]  95.25,82.55 0 top
LED1  [CHIPLED_1206]  356.87,82.55 270 top
LED2  [CHIPLED_1206]  105.41,5.08 0 top
LED3  [CHIPLED_0805]  90.81,74.93 180 top
LED4  [CHIPLED_0805]  88.9,74.93 180 top
LED5  [CHIPLED_0805]  209.55,70.48 0 top
LED6  [CHIPLED_0805]  215.26,70.48 0 top
LED7  [CHIPLED_0805]  262.89,124.46 0 top  (outside the outline)
LED8  [CHIPLED_0805]  257.81,124.46 0 top  (outside the outline)
P1  M-2X14-DIL-100  [DIL-100-2X14]  167.64,40.64 270 top
P2  M-2X14-DIL-100  [DIL-100-2X14]  365.76,40.64 270 top
P3  M-2X16-DIL-100  [DIL-100-2X16]  7.62,35.56 270 bottom
P4  M-2X16-DIL-100  [DIL-100-2X16]  -8.26,35.24 90 top  (outside the outline)
P5  EVJ-POT  [EVJ-POT]  212.09,80.01 270 top
P6  EVJ-POT  [EVJ-POT]  212.09,104.14 270 top
P7  EVJ-POT  [EVJ-POT]  231.78,80.01 270 top
P8  EVJ-POT  [EVJ-POT]  229.87,99.06 270 top
P9  EVJ-POT  [EVJ-POT]  247.65,80.01 180 top
P10  EVJ-POT  [EVJ-POT]  247.65,99.06 180 top
R1  10k  [R0603]  112.39,3.17 270 top
R2  82k  [R0603]  220.34,10.79 90 top
R3  18k  [R0603]  222.25,10.79 270 top
R4  39  [R0603]  118.75,46.99 0 bottom
R5  39  [R0603]  118.75,45.09 0 bottom
R6  0  [R0603]  140.34,62.87 180 bottom
R7  0  [R0603]  135.89,58.1 270 bottom
R8  100k  [R0603]  81.92,54.29 180 bottom
R9  100k  [R0603]  326.39,81.28 0 top
R10  100k  [R0603]  330.83,81.28 180 top
R11  100k  [R0603]  341.63,81.28 180 top
R12  100k  [R0603]  337.19,81.28 0 top
R13  100k  [R0603]  345.44,81.28 0 top
R14  100k  [R0603]  349.88,81.28 180 top
R15  4.7k  [R0603]  124.46,90.17 180 bottom
R16  0  [R0603]  136.53,77.15 90 top
R17  0  [R0603]  133.99,77.15 90 top
R18  0  [R0603]  131.44,77.15 90 top
R19  47k  [R0603]  107.31,92.71 0 top
R20  47k  [R0603]  111.12,92.71 180 top
R21  150  [R0603]  356.87,80.01 0 top
R22  10k  [R0603]  120.65,90.17 0 bottom
R23  150  [R0603]  102.87,5.08 90 top
R24  0  [R0603]  87.63,62.23 180 top
R25  0  [R0603]  106.05,71.12 180 top
R26  0  [R0603]  106.05,69.22 180 top
R27  3.32k  [R0603]  107.63,73.03 0 top
R28  18k  [R0603]  242.57,10.79 270 top
R29  82k  [R0603]  240.66,10.79 90 top
R30  82k  [R0603]  260.99,10.79 90 top
R31  18k  [R0603]  262.89,10.79 90 top
R32  82k  [R0603]  281.31,10.79 90 top
R33  18k  [R0603]  283.21,10.79 90 top
R34  82k  [R0603]  363.86,88.9 90 top
R35  18k  [R0603]  365.76,88.9 90 top
R36  100k  [R0603]  165.74,98.42 90 bottom
R37  22  [R0603]  104.46,26.04 90 bottom
R38  18k  [R0603]  124.46,13.97 90 top
R39  82k  [R0603]  126.36,13.97 90 top
R40  18k  [R0603]  130.18,13.97 90 top
R41  82k  [R0603]  128.27,13.97 90 top
R42  0  [R0603]  106.05,74.93 180 top
R47  150  [R0603]  88.9,78.74 90 top
R48  10k  [R0603]  77.47,60.33 90 bottom
R49  0  [R0603]  83.82,9.53 270 top
R50  0  [R0603]  89.53,10.79 270 top
R51  10k  [R0603]  270.51,78.11 270 top
R52  10k  [R0603]  274.32,78.11 90 top
R53  10k  [R0603]  276.23,78.11 90 top
R54  10k  [R0603]  283.21,78.11 270 top
R55  10k  [R0603]  287.02,78.11 90 top
R56  10k  [R0603]  288.93,78.11 90 top
R57  10k  [R0603]  295.91,78.11 270 top
R58  10k  [R0603]  299.72,78.11 90 top
R59  10k  [R0603]  301.62,78.11 90 top
R60  10k  [R0603]  308.61,78.11 270 top
R61  10k  [R0603]  312.42,78.11 90 top
R62  10k  [R0603]  314.32,78.11 90 top
R63  330k  [R0603]  157.48,88.9 0 bottom
R64  100k  [R0603]  162.56,88.9 180 bottom
R65  10k  [R0603]  121.92,77.47 90 bottom
R66  10k  [R0603]  123.83,77.47 90 bottom
R67  1k  [R0603]  317.5,68.58 90 top
R68  0  [R0603]  315.66,101.6 0 top
R69  0  [R0603]  315.66,104.14 0 top
R70  4k7  [R0603]  85.72,9.53 270 top
R71  4k7  [R0603]  81.92,9.53 270 top
R72  10k  [R0603]  83.19,28.57 270 bottom
R73  10k  [R0603]  85.09,28.57 270 bottom
R74  33  [R0603]  81.28,60.33 90 bottom
R75  10k  [R0603]  70.8,38.42 0 bottom
R76  33  [R0603]  70.8,38.42 0 top
R77  150  [R0603]  90.81,78.74 90 top
R78  10k  [R0603]  100.97,49.85 0 bottom
R79  10k  [R0603]  100.97,47.94 0 bottom
R80  10k  [R0603]  81.92,56.2 0 bottom
R81  5K62  [R0603]  27.3,73.66 180 top
R82  11k  [R0603]  25.4,80.01 270 top
R83  5K62  [R0603]  25.4,76.52 90 top
R84  5K62  [R0603]  37.47,73.66 180 top
R85  3K01  [R0603]  27.3,80.01 90 top
R86  11k  [R0603]  28.26,82.55 180 top
R87  604  [R0603]  32.07,82.55 0 top
R88  1K5  [R0603]  27.3,76.52 90 top
R89  49k9  [R0603]  31.11,85.09 180 bottom
R90  11k  [R0603]  43.18,80.01 270 top
R91  5K62  [R0603]  43.18,76.52 90 top
R92  10k  [R0603]  21.59,47.62 270 top
R93  3k01  [R0603]  41.27,80.01 90 top
R94  11k  [R0603]  40.32,82.55 0 top
R95  604  [R0603]  36.51,82.55 180 top
R96  1k65  [R0603]  41.27,76.52 90 top
R97  49k9  [R0603]  37.47,85.09 0 bottom
R98  10k  [R0603]  21.59,51.44 270 top
R99  10k  [R0603]  35.56,49.53 270 top
R100  100  [R0603]  35.56,53.34 270 top
R101  10k  [R0603]  23.5,47.62 270 top
R102  10k  [R0603]  28.57,53.98 180 top
R133  5k76  [R0603]  72.39,81.92 90 top
R134  5k76  [R0603]  72.39,78.11 90 top
R135  237  [R0603]  67.31,80.64 180 bottom
R136  5k76  [R0603]  58.42,81.92 90 top
R137  5k76  [R0603]  58.42,78.11 270 top
R139  237  [R0603]  63.5,80.64 0 bottom
R162  100k  [R0603]  165.74,94.61 270 bottom
R164  562  [R0603]  53.66,34.92 180 top
R165  10k  [R0603]  63.5,39.69 90 bottom
R166  100k  [R0603]  67.31,53.34 180 top
R167  0  [R0603]  84.77,42.86 90 bottom
R168  0  [R0603]  86.68,42.86 90 bottom
T-AGND  [1X01]  3.81,69.85 0 top
U1  AT32UC3A0512  [LQFP144]  133.35,55.88 180 top
U2  FT232RL  [SSOP28]  120.65,85.72 90 top
U3  CY62167EV30-Z  [TSOP48]  157.48,55.88 0 top
U4  TPS2020  [SO08]  109.22,88.9 90 top
U5  AD7923  [TSSOP16]  320.04,63.5 90 top
U6  LM2678  [TO263-7]  146.05,87.63 0 top
U7  ADP3339  [SOT223]  133.99,83.5 180 top
U8  ADP3339  [SOT223]  96.52,74.93 90 top
U9  MT48LC32M16A2tg-75  [TSOP54]  101.6,20.32 0 top
U10  LM4040M3  [SOT23]  321.94,68.58 180 top
U11  74LS595D  [SO16]  49.53,8.89 180 top
U12  74LS595D  [SO16]  38.1,8.89 180 top
U13  74LS595D  [SO16]  26.67,8.89 180 top
U14  AD1939  [SQFP-S-10X10-64]  62.23,43.18 0 top
U17  AD5686R  [TSSOP16]  67.31,8.89 180 top
U18  FDS9431A  [SO08]  100.97,64.14 0 top
U19  74HC14D  [SO14']  298.45,18.41 90 top
U20  SN74LVC2G14  [SOT23-6]  130.18,19.05 0 top
U21  AD5628  [TSSOP16]  59.69,8.89 180 top
U$1  PANASONIC-EVQ  [PANASONIC-EVQ]  109.22,5.08 270 top
U$2  BOURNS-EM14  [BOURNS-EM14]  351.79,17.78 0 bottom
U$3  BOURNS-EM14  [BOURNS-EM14]  316.23,18.42 0 bottom
U$4  BOURNS-EM14  [BOURNS-EM14]  334.01,48.9 0 bottom
U$5  BOURNS-EM14  [BOURNS-EM14]  298.45,48.26 0 bottom
U$6  SDMMC06132  [06132]  334.01,86.36 180 top
U$7  BAS70-04  [SOT23]  276.23,74.3 270 top
U$10  NHD-2.7  [NHD-2.7]  243.84,59.05 0 top
U$11  BAS70-04  [SOT23]  288.93,74.3 270 top
U$12  BAS70-04  [SOT23]  301.62,74.3 270 top
U$13  BAS70-04  [SOT23]  314.32,74.3 270 top
VDDINT  TPS-SMD-10R  [SMD-10R]  92.71,62.23 0 top
VDDOUT  TPS-SMD-10R  [SMD-10R]  135.57,68.58 180 top
Y1  12mhz  [HC49UP@1]  133.35,36.83 0 top
Y2  ASFL1-27mhz  [ASFL1]  79.38,62.87 0 top
Y3  ASFL1-12.288mhz  [ASFL1]  69.53,34.92 0 top

## Tracks (layer width: path | path; a pad name or v marks a point on that pad's centre or on a via)
+3V3  (via drill 0.38, 0.6, 0.7)  (1 unrouted)
  Top 0.254: U2.4 126.73,83.45 130.18,80.01 v130.18,78.74 | U5.15 315.95,61.88 315.91,61.84 | 315.09,62.23 C70.2 | 3V3.TP v113.67,75.56 | v156.84,44.45 157.23,44.84 U3.12 | U3.37 157.23,63.88 v156.84,63.5 | v105.41,1.91 LED2.A | R1.2 v112.39,1.27 | JP1.4 118.11,8.38 C41.1 | R9.2 v328.3,81.28 R10.2 | U$6.4 334.61,82.52 334.01,81.92 v334.01,81.28 | R12.2 v339.09,81.28 R11.2 | R13.2 v347.35,81.28 R14.2 | v353.69,82.55 LED1.A 357.02,84.45 365.76,84.45 v368.3,81.92
  Top 0.406: 315.95,61.88 315.6,62.23 315.09,62.23 | C70.2 314.2,62.36 313.69,62.87 C71.+ | 315.91,61.84 315.91,60.96 316.87,60.01 v316.87,59.69 | C127.+ 367.03,12.7 366.52,13.21 C125.2 366.52,14.48 365.76,15.24 362.58,15.24 361.31,16.51 361.31,23.5 P2.25
  Top 0.61: v131.44,74.93 R18.1 | v368.3,13.97 C125.2 | v327.66,63.5 v345.44,63.5 | v356.87,63.5 v367.03,63.5
  Bottom 0.203: v121.92,75.56 R65.1 R66.1
  Bottom 0.254: C37.1 v156.84,44.45 | C35.1 v156.84,63.5 | v328.3,81.28 v334.01,81.28 v339.09,81.28 v347.35,81.28 352.43,81.28 v353.69,82.55
  Bottom 0.61: 368.3,63.5 v368.3,13.97 | 368.3,63.5 v368.3,81.92 | v327.66,63.5 323.85,59.69 v316.87,59.69 271.14,59.69 269.24,61.59 267.33,61.59 265.43,59.69 JP4.2 | v345.44,63.5 v356.87,63.5 | v367.03,63.5 368.3,63.5
  pour Route2 (isolate 0.305): 134.62,74.93 134.62,77.47 133.35,78.74 113.03,78.74 111.76,77.47 114.3,74.93 114.3,11.43 104.14,1.27 104.14,0 172.72,0 172.72,111.76 156.21,111.76 156.21,72.39 154.94,71.12 147.32,71.12 147.32,43.18 144.78,40.64 123.19,40.64 119.38,44.45 119.38,66.04 123.19,69.85 129.54,69.85
+3V3A  (via drill 0.38, 0.6)
  Top 0.254: U17.10 65.69,7.66 65.09,8.26 v64.14,8.26 | IC3.8 36.2,80.64 v34.92,79.38 | C188.1 v52.7,35.88 52.7,35.12 R164.2 | IC6.8 60.45,77.47 C149.2 v60.33,76.2 | C133.1 33.15,52.07 IC25.8 v29.53,52.07 | U14.51 57.68,45.93 v58.1,46.35 | U14.45 59.98,46.38 v60.01,46.35 | U14.62 57.89,40.43 v58.1,40.32 | U14.5 60.48,38.89 v60.64,39.05
  Top 0.406: L7.1 v92.08,85.72 91.76,85.41 C190.+
  Bottom 0.254: C146.1 57.98,46.48 v58.1,46.35 | 59.24,48.45 C145.1 59.24,48.36 59.98,47.62 59.98,46.38 v60.01,46.35 | 57.02,39.88 C144.1 56.96,40.01 57.78,40.01 v58.1,40.32 | v34.92,79.38 34.92,80.52 C103.2 | v60.64,39.05 60.64,37.97 C143.1
  pour Route2: 0,111.76 96.52,111.76 96.52,72.39 68.58,72.39 62.23,66.04 62.23,24.13 72.39,13.97 72.39,0 0,0
+3V3C  (via drill 0.38, 0.6)  (8 unrouted)
  Top 0.152: v83.82,54.29 81.6,56.52 80.64,56.52 79.38,57.78 79.38,64.77 78.74,65.41 v78.11,65.41 | Y3.4 v68.26,37.78 | R71.1 v81.92,12.7 | v86.36,49.85 v99.06,49.85 | U17.11 66.33,5.1 66.36,5.08 66.36,1.27
  Top 0.254: U9.49 95.2,24.82 v95.89,24.13 | U9.43 100,24.14 v100.01,24.13 | U9.9 97.6,12.89 v98.11,12.38 | U9.14 101.6,13.02 v102.23,12.38 | U9.27 112,13.1 v112.71,12.38 | U9.1 91.2,13.57 91.76,13.02 93.03,13.02 | v93.03,12.38 93.03,13.02 | U9.3 92.8,13.75 C179.2 93.03,13.02 | v78.11,65.41 Y2.4 | v110.49,71.75 3V3C.TP | R166.1 v69.22,53.34 | v80.64,70.48 81.92,71.75 85.09,71.75 87.63,74.3 87.63,79.06 88.08,79.5 R47.2 R77.2 | U13.16 v31.11,4.45 31.11,1.27 | 34.92,4.45 U12.10 34.92,1.27 | U12.16 v42.55,4.45 42.55,1.27 | 46.35,4.45 U11.10 46.35,1.27 | U11.16 v53.98,4.45 53.98,1.27 | 31.11,1.27 23.5,1.27 U13.10 | 31.11,1.27 34.92,1.27 | 34.92,1.27 42.55,1.27 | 42.55,1.27 46.35,1.27 | 46.35,1.27 53.98,1.27 | 53.98,1.27 66.36,1.27 v79.69,1.27 | U14.17 67.37,39.43 v66.67,38.73 | U14.32 66.61,46.93 v66.36,46.67
  Top 0.406: v108.58,74.93 R42.1 106.68,75.06 106.68,76.83 105.41,78.11 105.41,83.19 102.87,85.72 L7.2
  Bottom 0.152: R8.2 v83.82,54.29 86.36,51.75 v86.36,49.85 | v68.26,37.78 68.9,38.42 R75.2 71.56,36.89 C97.1 | R79.2 R78.2 v99.06,49.85 | R72.2 R73.2 85.92,27.81 v86.36,28.26
  Bottom 0.254: C182.2 v95.89,24.13 | C181.2 v100.01,24.13 | C183.2 97.47,13.02 v98.11,12.38 | C180.2 101.6,13.02 v102.23,12.38 | C184.2 112.08,13.02 v112.71,12.38 | v93.03,12.38 C179.2 C42.2 | v78.11,65.41 78.11,62.87 77.47,62.23 R48.2 C96.1 | 65.53,38.73 C189.1 65.6,38.73 v66.67,38.73 | C119.1 30.61,4.95 v31.11,4.45 | C118.1 42.04,4.95 v42.55,4.45 | C117.1 53.47,4.95 v53.98,4.45 | C142.1 67.5,45.85 66.99,46.35 66.67,46.35 v66.36,46.67
  pour Route2: 109.22,76.2 110.49,76.2 113.03,73.66 113.03,12.7 102.87,2.54 102.87,0 73.66,0 73.66,15.24 63.5,25.4 63.5,64.77 69.85,71.12 74.93,71.12 74.93,30.48 76.2,29.21 106.68,29.21 107.95,30.48 107.95,60.96 106.68,62.23 76.2,62.23 76.2,71.12 104.14,71.12
+5V  (via drill 0.38, 0.6, 0.7)  (2 unrouted)
  Top 0.254: U2.20 119.04,86.7 v119.38,86.36 | R19.2 108.08,92.84 v109.22,93.98 110.36,92.84 R20.2 | U4.3 113.03,89.53 v113.67,88.9 113.03,88.27 U4.2 | 5V.TP v112.39,82.55 | 297.81,12.83 C34.2 | 363.86,85.72 R34.1 | R39.1 R41.1 v128.27,12.06 | v130.18,21.27 U20.5
  Top 0.406: C2.2 v98.11,80.01 | U8.3 99.62,79.93 C2.2 | C2.2 C3.+ | C128.+ 367.03,18.41 366.52,18.92 C126.2 | 260.99,1.27 281.31,1.27 | 281.31,1.27 v297.81,1.27 297.81,12.83 297.81,13.97 297.18,14.61 U19.14 294,14.61 v293.37,13.97 | 260.99,1.27 240.66,1.27 | 240.66,1.27 227.97,1.27 220.34,8.89 R2.1 | 240.66,1.27 R29.1 | 260.99,1.27 R30.1 | 281.31,1.27 R32.1 | U$5.P$5 296.55,39.88 C63.2 | U$4.P$5 332.11,40.51 C62.2 333.25,38.61 332.11,37.47 297.81,37.47 293.37,33.02 v293.37,22.23 | U$2.P$5 349.88,9.4 C60.2 | U$3.P$5 314.32,10.03 C61.2 | v369.57,19.68 C126.2 | P2.26 365.76,25.4 365.76,21.59 366.52,20.83 C126.2
  Top 0.61: U7.3 131.67,88.04 130.81,88.9 C47.2 v130.81,92.08 | 148.59,80.01 U6.6 | 148.59,80.01 v152.4,80.01 158.17,85.78 L1.2 160.07,85.72 160.66,85.72 164.47,81.92 164.47,68.58 171.45,61.59 171.45,29.21 P1.26 | 148.59,80.01 147.96,79.38 147.96,77.6 C46.1 | v368.3,83.82 366.39,85.72 363.86,85.72 354.33,85.72 338.45,101.6 R68.2
  Bottom 0.254: v119.38,86.36 119.89,85.85 C53.2 119.89,84.96 119.38,84.45 C54.+ | v128.27,12.06 128.27,19.37 v130.18,21.27 161.61,21.27 165.74,25.4 167.64,25.4 P1.26
  Bottom 0.406: 369.57,7.62 363.22,1.27 349.88,1.27 | v297.81,1.27 314.32,1.27 | 314.32,1.27 349.88,1.27 | 314.32,1.27 U$3.P$5 | 349.88,1.27 U$2.P$5 | v293.37,13.97 v293.37,22.23
  Bottom 0.61: 369.57,7.62 v369.57,19.68 369.57,82.55 v368.3,83.82 | v130.81,92.08 C47.2
  pour Route2 (isolate 0.305): 153.67,72.39 143.51,72.39 135.89,80.01 110.49,80.01 102.87,72.39 97.79,72.39 97.79,111.76 154.94,111.76 154.94,73.66
+5VA  (via drill 0.38)  (2 unrouted)
  Top 0.254: U5.5 323.86,63.83 324.17,64.14 | C68.2 324.8,64.77 324.17,64.14 | U5.6 323.83,64.47 324.17,64.14 | U$7.2 272.1,73.34 270.51,74.93 R51.2 | U$12.2 297.5,73.34 295.91,74.93 R57.2 | U$11.2 284.8,73.34 283.21,74.93 R54.2 | U$13.2 310.19,73.34 308.61,74.93 R60.2 | U17.5 v66.98,13.01 v66.99,13.02 | U21.3 60.66,12.99 v60.64,13.02
  Top 0.406: 281.31,101.6 269.88,101.6 267.97,99.69 267.97,78.11 268.73,77.34 R51.2 | 281.31,101.6 294,101.6 | 294,101.6 306.7,101.6 | 306.7,101.6 313.06,101.6 | 313.06,101.6 R68.1 | 281.31,101.6 281.31,78.11 282.07,77.34 R54.2 | 294,101.6 294,78.11 294.77,77.34 R57.2 | 306.7,101.6 306.7,78.11 307.47,77.34 R60.2 | 313.06,101.6 313.06,97.16 315.6,94.61 315.6,88.27 318.13,85.72 318.13,72.39 | C69.+ 325.75,69.85 323.21,72.39 318.13,72.39 | 318.13,72.39 316.23,70.48 316.23,68.58 316.99,67.82 R67.1
  Top 0.61: C68.2 324.99,65.28 325.75,66.04 C69.+
  Bottom 0.254: 66.99,10.6 v66.99,13.02 | C120.1 66.99,10.6 | C121.+ 67.44,10.16 66.99,10.6 | v60.64,13.02 60.64,10.48 C123.+ 59.69,10.16 59.18,9.65 C122.1
A-A1
  Top 0.152: U1.118 144.9,51.63 145.41,51.12 146.69,51.12 147.32,51.75 153.99,51.75 163.23,60.99 U3.25
A-A2
  Top 0.152: U1.114 145.83,49.63 147.64,51.44 160.02,51.44 163.23,48.23 U3.24
A-A3
  Top 0.152: U1.112 145.68,48.63 146.37,47.94 146.69,47.94 147.64,48.9 147.64,50.8 147.96,51.12 159.7,51.12 162.73,48.09 U3.23
A-A4
  Top 0.152: U1.110 144.78,47.63 145.1,47.31 146.69,47.31 147.96,48.58 147.96,50.48 148.27,50.8 159.38,50.8 162.23,47.95 U3.22
A-A5
  Top 0.152: U1.107 141.6,44.45 141.92,44.13 144.15,44.13 148.27,48.26 148.27,50.16 148.59,50.48 159.07,50.48 161.73,47.82 U3.21
A-A6
  Top 0.152: U1.105 140.6,44.5 141.29,43.81 144.46,43.81 148.59,47.94 148.59,49.85 148.91,50.16 158.75,50.16 161.23,47.69 U3.20
A-A7
  Top 0.152: U1.103 139.6,44.23 140.34,43.5 144.78,43.5 148.91,47.62 148.91,49.53 149.22,49.85 158.43,49.85 160.73,47.55 U3.19
A-A8
  Top 0.152: U1.101 138.6,44.28 139.7,43.18 145.1,43.18 149.22,47.31 149.22,49.21 149.54,49.53 158.12,49.53 160.23,47.41 U3.18
A-A9
  Top 0.152: U1.99 137.6,44.33 139.06,42.86 145.41,42.86 149.54,46.99 149.54,48.9 149.86,49.21 153.99,49.21 155.23,47.97 U3.8
A-A10
  Top 0.152: U1.97 136.6,44.38 138.43,42.55 145.73,42.55 149.86,46.67 149.86,48.58 150.18,48.9 153.67,48.9 154.73,47.84 U3.7
A-A11
  Top 0.152: U1.95 135.6,44.42 137.79,42.23 146.05,42.23 150.18,46.35 150.18,48.26 150.5,48.58 153.35,48.58 154.23,47.7 U3.6
A-A12
  Top 0.152: U1.91 133.6,42.93 134.62,41.91 146.37,41.91 150.5,46.04 150.5,47.94 150.81,48.26 153.03,48.26 153.73,47.56 U3.5
A-A13
  Top 0.152: U1.89 132.6,43.3 134.3,41.59 146.69,41.59 150.81,45.72 150.81,47.62 151.13,47.94 152.72,47.94 153.23,47.43 U3.4
A-A14
  Top 0.152: U1.87 131.6,43.02 133.35,41.27 147,41.27 151.13,45.4 151.13,47.31 151.45,47.62 152.4,47.62 152.73,47.3 U3.3
A-A15
  Top 0.152: U1.67 123.72,49.63 124.14,49.21 124.14,46.99 122.87,45.72 122.87,42.86 125.73,40.01 147,40.01 152.23,45.23 U3.2
A-A16
  Top 0.152: U1.65 124.63,50.63 125.09,50.16 125.09,47.31 123.51,45.72 123.51,42.86 125.73,40.64 147,40.64 151.73,45.37 U3.1
A-A17  (via drill 0.38)
  Top 0.152: U1.63 124.34,51.63 125.73,53.02 134.62,53.02 135.89,51.75 136.84,51.75 137.48,52.39 137.48,54.61 136.84,55.24 136.84,58.74 144.15,66.04 v145.41,66.04 | v149.54,66.04 150.81,66.04 151.13,66.36 151.45,66.36 151.73,66.08 U3.48
  Bottom 0.152: v145.41,66.04 v149.54,66.04
A-A18  (via drill 0.38)
  Top 0.152: U1.61 124.39,52.63 125.41,53.66 135.57,53.66 v136.53,52.7 | v147,53.34 147.64,53.34 147.96,53.66 v154.94,53.66 | U3.17 159.73,45.11 v158.12,43.5
  Bottom 0.152: v136.53,52.7 137.48,51.75 145.41,51.75 v147,53.34 | v154.94,53.66 159.07,49.53 159.07,44.45 v158.12,43.5
A-A19  (via drill 0.38)
  Top 0.152: U1.59 124.43,53.63 125.09,54.29 135.89,54.29 v136.53,53.66 | v147,54.29 v153.35,54.29 | U3.16 159.23,45.25 158.75,44.77 v158.12,44.77
  Bottom 0.152: v136.53,53.66 137.79,52.39 145.1,52.39 v147,54.29 | v153.35,54.29 158.43,49.21 158.43,45.09 v158.12,44.77
A-D0
  Top 0.152: U3.29 161.23,66.42 156.53,71.12 126.05,71.12 122.24,67.31 122.24,66.36 121.28,65.41 121.28,64.77 121.92,64.13 U1.38
A-D1
  Top 0.152: U1.35 125.1,68.58 127.32,70.8 155.89,70.8 160.23,66.47 U3.31
A-D2
  Top 0.152: U1.33 126.1,67.68 128.91,70.48 155.26,70.48 159.23,66.51 U3.33
A-D3
  Top 0.152: U1.31 127.1,68.05 129.22,70.17 154.62,70.17 158.23,66.56 U3.35
A-D4
  Top 0.152: U1.26 129.6,68 131.44,69.85 153.35,69.85 156.73,66.47 U3.38
A-D5
  Top 0.152: U1.24 130.6,68.37 131.76,69.53 152.72,69.53 155.73,66.52 U3.40
A-D6
  Top 0.152: U1.12 136.6,68.02 137.79,69.22 152.08,69.22 154.73,66.57 U3.42
A-D7
  Top 0.152: U1.10 137.6,68.39 138.11,68.9 151.45,68.9 153.73,66.61 U3.44
A-D8  (via drill 0.38)
  Top 0.152: U1.4 140.6,67.58 141.6,68.58 150.81,68.58 v151.13,68.26 | U3.30 160.73,64.06 v160.66,63.82
  Bottom 0.152: v151.13,68.26 156.21,68.26 v160.66,63.82
A-D9  (via drill 0.38)
  Top 0.152: U1.2 141.6,67.31 142.56,68.26 149.86,68.26 v150.18,67.94 | U3.32 159.73,64.16 v159.38,63.82
  Bottom 0.152: v150.18,67.94 150.5,67.63 155.57,67.63 v159.38,63.82
A-D10  (via drill 0.38)
  Top 0.152: U1.1 142.1,67.17 142.88,67.94 148.91,67.94 v149.22,67.63 | v159.38,62.87 158.73,63.52 U3.34
  Bottom 0.152: v149.22,67.63 151.13,65.72 156.53,65.72 v159.38,62.87
A-D11  (via drill 0.38)
  Top 0.152: U1.144 144.96,64.63 v145.41,65.09 | U3.36 157.73,63.57 v158.43,62.87
  Bottom 0.152: v145.41,65.09 156.21,65.09 v158.43,62.87
A-D12  (via drill 0.38)
  Top 0.152: U1.142 145.54,63.63 v146.05,64.14 | U3.39 156.23,64.47 v155.57,63.82
  Bottom 0.152: v146.05,64.14 146.37,64.45 154.94,64.45 v155.57,63.82
A-D13  (via drill 0.38)
  Top 0.152: U1.140 146.13,62.63 v147,63.5 | U3.41 155.26,65.09 155.26,64.45 v153.99,63.18
  Bottom 0.152: v147,63.5 147.32,63.82 153.35,63.82 v153.99,63.18
A-D14  (via drill 0.38)
  Top 0.152: U1.137 145.9,61.13 v147.96,63.18 | U3.43 154.23,64.38 153.67,63.82 153.35,63.82 v152.72,63.18
  Bottom 0.152: v147.96,63.18 v152.72,63.18
A-D15  (via drill 0.38)
  Top 0.152: U1.135 147.76,60.13 148.59,60.96 v148.59,62.23 | v151.13,62.23 151.13,62.87 152.4,64.14 153.03,64.14 153.23,64.33 U3.45
  Bottom 0.152: v148.59,62.23 v151.13,62.23
A-RESET  (via drill 0.38)
  Top 0.152: U1.23 131.1,64.8 v131.13,64.77 130.18,63.82 125.41,63.82 v123.19,66.04 | v115.89,63.82 v120.33,68.26 | U$1.2 v109.22,9.53
  Top 0.254: U$1.2 109.22,7.62 110.49,6.35 112.27,6.35 C1.1 | R1.1 C1.1 | JP1.6 119.38,5.08 114.94,5.08 113.67,6.35 112.52,6.35 C1.1
  Bottom 0.152: v123.19,66.04 120.97,68.26 v120.33,68.26 | v115.89,63.82 113.35,61.28 113.35,55.24 114.62,53.98 114.62,46.04 123.19,37.47 123.19,32.38 116.2,25.4 116.2,13.34 112.39,9.53 v109.22,9.53
A-TCK  (via drill 0.38)
  Top 0.152: v152.08,40.32 143.51,31.75 130.18,31.75 v127.95,29.53 | U1.129 147.34,57.13 v147.64,57.47
  Bottom 0.152: v147.64,57.47 150.18,54.93 150.18,43.18 152.08,41.27 v152.08,40.32 | v127.95,29.53 118.75,20.32 118.75,10.79 121.92,7.62 121.92,3.17 121.28,2.54 116.84,2.54 JP1.1
A-TDI  (via drill 0.38)
  Top 0.152: v149.54,40.32 142.24,33.02 127.64,33.02 v126.05,31.43 | U1.131 145.12,58.13 v145.41,58.42
  Top 0.254: v117.47,13.97 124.46,6.99 124.46,5.08 JP1.9
  Bottom 0.152: v145.41,58.42 145.41,57.78 148.91,54.29 148.91,42.55 149.54,41.91 v149.54,40.32 | v126.05,31.43 117.47,22.86 v117.47,13.97
A-TDO  (via drill 0.38)
  Top 0.152: v150.81,40.32 142.88,32.38 128.91,32.38 v127,30.48 | U1.130 145.9,57.63 v146.69,58.42
  Bottom 0.152: v146.69,58.42 146.69,57.47 149.54,54.61 149.54,42.86 150.81,41.59 v150.81,40.32 | v127,30.48 118.11,21.59 118.11,10.16 119.38,8.89 119.38,5.08 JP1.3
A-TMS  (via drill 0.38)
  Top 0.152: v148.27,40.32 141.6,33.66 126.36,33.66 v125.09,32.38 | U1.128 145.62,56.63 v146.05,56.2
  Top 0.254: v116.84,12.06 121.92,6.99 121.92,5.08 JP1.5
  Bottom 0.152: v146.05,56.2 148.27,53.98 v148.27,40.32 | v125.09,32.38 116.84,24.13 v116.84,12.06
ABE0_  (via drill 0.38)
  Top 0.152: DSP1.P$151 103.03,43.97 99.69,40.64 99.69,37.15 103.19,33.66 v103.19,32.07 | v103.19,24.13 103.19,20.32 102.55,19.68 102.55,16.19 102.4,16.04 U9.15
  Bottom 0.152: v103.19,24.13 v103.19,32.07
ABE1_  (via drill 0.38)
  Top 0.152: DSP1.P$150 103.16,43.47 100.01,40.32 100.01,37.47 v103.82,33.66 | U9.39 103.2,27.61 v103.82,28.26
  Bottom 0.152: v103.82,28.26 v103.82,33.66
AD1939_RESET  (via drill 0.38)
  Top 0.152: DSP1.P$50 v76.84,53.97 v76.83,53.98 | U14.14 64.98,38.52 64.45,39.05 v62.23,39.05
  Bottom 0.152: v76.83,53.98 72.07,53.98 66.36,48.26 65.09,48.26 64.14,47.31 64.14,42.55 62.23,40.64 v62.23,39.05 63.37,39.05 R165.1
AGND  (via drill 0.38, 0.6)  (9 unrouted)
  Top 0.254: C69.- 327.66,67.31 327.02,66.67 327.02,66.04 326.52,65.53 C68.1 | C68.1 326.39,64.77 | U5.4 321.95,63.17 321.63,63.5 | 322,65.78 U5.8 321.57,65.78 | U5.13 318.14,63.17 318.45,62.87 | 318.45,62.87 318.45,61.59 318.08,61.23 U5.16 | 321.63,63.5 v320.04,63.5 319.4,62.87 318.45,62.87 | 321.57,65.78 v320.68,66.67 320.68,67.94 | U10.2 321,68.27 320.68,67.94 | C72.1 320.55,67.82 320.68,67.94 | 321.63,63.5 321.63,65.72 321.57,65.78 | C68.1 v327.66,64.77 | C100.- 53.34,48.26 53.85,47.75 C99.1 v54.61,48.9 | C102.- 56.83,52.07 57.34,51.56 C101.1 v56.2,50.8 | U17.4 67.64,9.21 v67.31,8.89 | U17.16 69.58,6.72 v70.48,7.62 | v27.3,4.45 U13.13 27.3,7.62 26.67,8.26 23.5,8.26 22.23,9.53 U13.8 | U12.8 33.66,9.53 34.92,8.26 38.1,8.26 38.73,7.62 U12.13 v38.73,4.45 | U11.8 45.09,9.53 46.35,8.26 49.53,8.26 50.16,7.62 U11.13 v50.16,4.45 | 29.02,75.56 C107.1 29.34,75.88 29.84,75.88 30.8,76.83 IC3.4 v33.66,76.83 | 39.37,75.88 C113.1 38.8,75.75 R84.2 v35.56,73.66 | R81.2 v25.4,73.66 | C105.2 v33.02,73.66 | C111.2 v43.18,73.66 | C148.1 70.36,81.28 IC6.4 IC6.3 66.04,80.01 v65.41,79.38 | IC6.5 63.5,81.28 v65.41,79.38 | C149.1 60.33,78.74 60.96,78.11 64.14,78.11 v65.41,79.38 | IC25.3 IC25.4 v28.57,48.26 IC25.5 | C133.2 v33.66,55.24 | U14.46 59.48,47.41 v59.05,46.99 58.48,47.56 U14.48 | U14.44 60.48,47.47 v60.96,46.99 | U14.4 59.98,38.76 v59.69,39.05 59.05,39.05 58.48,38.48 U14.1 | C64.2 R53.2 v276.23,80.01 | U$7.1 274,75.25 v273.05,74.3 | U$11.1 286.7,75.25 v285.75,74.3 | U$12.1 299.4,75.25 v298.45,74.3 | v288.93,80.01 R56.2 C65.2 | C66.2 R59.2 v301.62,80.01 | C67.2 R62.2 v314.32,80.01 | U$13.1 312.1,75.25 v311.15,74.3 | U21.14 60.66,7.92 v59.69,8.89
  Top 0.406: L8.1 v92.08,82.55 91.76,82.87 C190.-
  Top 0.61: R69.1 v313.06,104.14
  Bottom 0.254: C146.2 57.66,44.96 v58.1,45.4 | 60.77,48.7 C145.2 60.77,47.18 v60.96,46.99 | C121.- v67.31,8.89 66.67,8.26 66.17,8.26 C120.2 | v27.3,4.45 27.3,4.57 C119.2 | v38.73,4.45 38.73,4.57 C118.2 | v50.16,4.45 50.16,4.57 C117.2 | C108.1 31.3,84.52 R89.2 | C108.1 33.21,80.64 C103.1 33.66,80.52 v33.66,76.83 | R97.2 36.7,84.26 37.15,83.82 37.15,82.68 C114.1 C110.1 39.56,83.06 v40.32,83.82 | C152.2 66.04,78.74 v65.41,79.38 64.77,78.74 C153.1 | C108.1 C104.1 | C144.2 57.91,41.4 v58.1,41.59 | v59.69,39.05 59.05,38.42 59.05,37.91 C143.2 | C122.2 58.93,8.13 v59.69,8.89 C123.-
  pour Route3 (isolate 0.305): 97.79,111.76 97.79,86.36 88.9,77.47 78.74,77.47 62.23,60.96 62.23,24.13 72.39,13.97 72.39,0 0,0 0,111.76
  pour Bottom: 314.96,111.76 314.96,87.63 330.2,72.39 330.2,67.31 322.58,59.69 273.05,59.69 264.16,68.58 198.12,68.58 198.12,111.76
B-A1  (via drill 0.38)
  Top 0.152: DSP1.P$149 108.16,42.97 v110.81,40.32 | v110.81,22.54 110.81,18.73 108.8,16.73 U9.23
  Bottom 0.152: v110.81,22.54 v110.81,40.32
B-A2  (via drill 0.38)
  Top 0.152: DSP1.P$148 107.39,42.47 v111.44,38.42 | v111.44,20.95 111.44,18.41 109.6,16.57 U9.24
  Bottom 0.152: v111.44,20.95 v111.44,38.42
B-A3  (via drill 0.38)
  Top 0.152: DSP1.P$147 106.62,41.97 v112.08,36.51 | v112.08,19.37 112.08,18.1 110.4,16.42 U9.25
  Bottom 0.152: v112.08,19.37 v112.08,36.51
B-A4  (via drill 0.38)
  Top 0.152: DSP1.P$146 105.85,41.47 v112.71,34.61 | U9.26 111.2,16.27 v112.71,17.78
  Bottom 0.152: v112.71,17.78 v112.71,34.61
B-A5
  Top 0.152: DSP1.P$142 106.26,39.47 109.54,36.2 109.54,29.21 111.2,27.55 U9.29
B-A6
  Top 0.152: U9.30 110.4,27.39 108.9,28.89 108.9,36.2 106.13,38.97 DSP1.P$141
B-A7